# EAGLE design avr-isp-adapter (EAGLE 7.4.0)
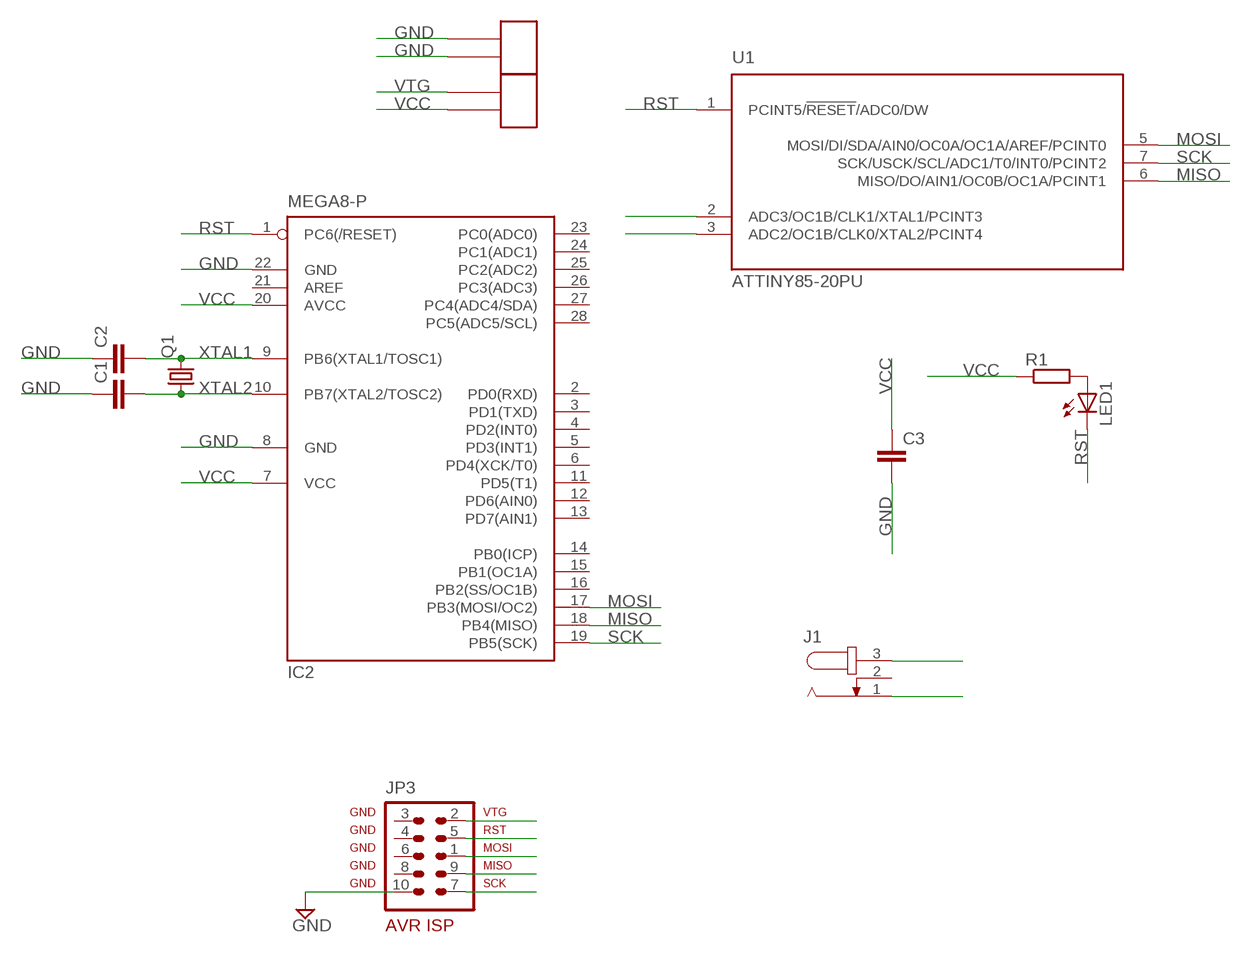
[diagram p0: schematic, sheet 1]

## Parts
C1  C-EUC0805  [C0805]
C2  C-EUC0805  [C0805]
C3  C-EUC0805  [C0805]
IC2  MEGA8-P  [DIL28-3]
J1  JACK-PLUG1  [SPC4078]
JP3  AVR-ISP-10  [AVR-ISP-10]
LED1  LED3MM  [LED3MM]
Q1  CRYSTALHC49S  [HC49/S]
R1  R-EU_M0805  [M0805]
U1  ATTINY85-20PU  [DIP-8]
U$1  MA02-1  [MA02-1]
U$2  MA02-1  [MA02-1]

## Nets
GND: C1.1 C2.1 C3.2 IC2.8(GND) IC2.22(GND) J1.1 JP3.10 U$2.P1 U$2.P2
MISO: IC2.18(PB4(MISO)) JP3.9 U1.6(MISO/DO/AIN1/OC0B/OC1A/PCINT1)
MOSI: IC2.17(PB3(MOSI/OC2)) JP3.1 U1.5(MOSI/DI/SDA/AIN0/OC0A/OC1A/AREF/PCINT0)
N$1: LED1.A R1.2
RST: IC2.1(PC6(/RESET)) JP3.5 LED1.K(C) U1.1(PCINT5/!RESET!/ADC0/DW)
SCK: IC2.19(PB5(SCK)) JP3.7 U1.7(SCK/USCK/SCL/ADC1/T0/INT0/PCINT2)
VCC: C3.1 IC2.7(VCC) IC2.20(AVCC) J1.3 R1.1 U$1.P2
VTG: JP3.2 U$1.P1
XTAL1: C2.2 IC2.9(PB6(XTAL1/TOSC1)) Q1.2 U1.2(ADC3/OC1B/CLK1/XTAL1/PCINT3)
XTAL2: C1.2 IC2.10(PB7(XTAL2/TOSC2)) Q1.1 U1.3(ADC2/OC1B/CLK0/XTAL2/PCINT4)
Unconnected: IC2.2(PD0(RXD)) IC2.3(PD1(TXD)) IC2.4(PD2(INT0)) IC2.5(PD3(INT1)) IC2.6(PD4(XCK/T0)) IC2.11(PD5(T1)) IC2.12(PD6(AIN0)) IC2.13(PD7(AIN1)) IC2.14(PB0(ICP)) IC2.15(PB1(OC1A)) IC2.16(PB2(SS/OC1B)) IC2.21(AREF) IC2.23(PC0(ADC0)) IC2.24(PC1(ADC1)) IC2.25(PC2(ADC2)) IC2.26(PC3(ADC3)) IC2.27(PC4(ADC4/SDA)) IC2.28(PC5(ADC5/SCL)) J1.2 JP3.3 JP3.4 JP3.6 JP3.8

## Power pins joined to a net without a drawn wire
GND: U1.4(GND)
VCC: U1.8(VCC)

## Library data of the parts
C1-C3 = rcl:C-EU: CAPACITOR, European symbol
IC2 = atmel:MEGA8-P: MICROCONTROLLER 8 Kbytes FLASH, 1 kbytes SRAM, 512 bytes EEPROM, USART, 4-channel 10 bit ADC, 2-channel 8 bit ADC Pin compatible with Atmega48, ATMega88, ATMega168 Source: avr.lbr; OC_FARNELL: unknown; OC_NEWARK: unknown
J1 = con-jack:JACK-PLUG: DC POWER JACK Power Jack, DC, Right Angle, Through Hole, Rated 5A at 16VDC, PC Terminals Distributor: Farnell (www.Farnell.de) Drawing: 84N1161.pdf / 84N1162.pdf Manufacturer: SPC Technology (www.spctechnology.com) Type: SPC4077 / SPC 4078; OC_FARNELL: unknown; OC_NEWARK: unknown
JP3 = my-atmel:AVR-ISP-10: AVR ISP-10 Serial Programming Header
LED1 = adafruit:LED: LED OSRAM: - CHIPLED LG R971, LG N971, LY N971, LG Q971, LY Q971, LO R971, LY R971 LH N974, LH R974 LS Q976, LO Q976, LY Q976 LO Q996 - Hyper CHIPLED LW Q18S LB Q993, LB Q99A, LB R99A - SideLED LS A670, LO A670, LY A670, LG A670, LP A670 LB A673, LV A673, LT A673, LW A673 LH A674 LY A675 LS A676, LA A676, LO A676, LY A676, LW A676 LS A679, LY A679, LG A679 - Hyper Micro SIDELED® LS Y876, LA Y876, LO Y876, LY Y876 LT Y87S - SmartLED LW L88C, LW L88S LB L89C, LB L89S, LG L890 LS L89K, LO L89K, LY L89K LS L896, LA L896, LO L896, LY L896 - TOPLED LS T670, LO T670, LY T670, LG T670, LP T670 LSG T670, LSP T670, LSY T670, LOP T670, LYG T670 LG T671, LOG T671, LSG T671 LB T673, LV T673, LT T673, LW T673 LH T674 LS T676, LA T676, LO T676, LY T676, LB T676, LH T676, LSB T676, LW T676 LB T67C, LV T67C, LT T67C, LS T67K, LO T67K, LY T67K, LW E67C LS E67B, LA E67B, LO E67B, LY E67B, LB E67C, LV E67C, LT E67C LW T67C LS T679, LY T679, LG T679 LS T770, LO T770, LY T770, LG T770, LP T770 LB T773, LV T773, LT T773, LW T773 LH T774 LS E675, LA E675, LY E675, LS T675 LS T776, LA T776, LO T776, LY T776, LB T776 LHGB T686 LT T68C, LB T68C - Hyper Mini TOPLED® LB M676 - Mini TOPLED Santana® LG M470 LS M47K, LO M47K, LY M47K Source: http://www.osram.convergy.de/
Q1 = crystal:CRYSTAL: CRYSTAL; OC_FARNELL: 1667008; OC_NEWARK: unknown
R1 = rcl:R-EU_: RESISTOR, European symbol
U1 = volks73-Atmel:ATTINY*5-?: AVR® ATtiny2/4/85 Microcontroller Atmel 8-bit AVR Microcontroller with 2/4/8K Bytes In-System Programmable Flash Documentation Datasheet <http://www.atmel.com/images/atmel-2586-avr-8-bit-microcontroller-attiny25-attiny45-attiny85_datasheet.pdf> Features High Performance, Low Power AVR® 8-Bit Microcontroller Advanced RISC Architecture 120 Powerful Instructions – Most Single Clock Cycle Execution 32 x 8 General Purpose Working Registers Fully Static Operation Non-volatile Program and Data Memories 2/4/8K Bytes of In-System Programmable Program Memory Flash Endurance: 10,000 Write/Erase Cycles 128/256/512 Bytes In-System Programmable EEPROM Endurance: 100,000 Write/Erase Cycles 128/256/512 Bytes Internal SRAM Programming Lock for Self-Programming Flash Program and EEPROM Data Security Peripheral Features 8-bit Timer/Counter with Prescaler and Two PWM Channels 8-bit High Speed Timer/Counter with Separate Prescaler 2 High Frequency PWM Outputs with Separate Output Compare Registers Programmable Dead Time Generator USI – Universal Serial Interface with Start Condition Detector 10-bit ADC 4 Single Ended Channels 2 Differential ADC Channel Pairs with Programmable Gain (1x, 20x) Temperature Measurement Programmable Watchdog Timer with Separate On-chip Oscillator On-chip Analog Comparator Special Microcontroller Features debugWIRE On-chip Debug System In-System Programmable via SPI Port External and Internal Interrupt Sources Low Power Idle, ADC Noise Reduction, and Power-down Modes Enhanced Power-on Reset Circuit Programmable Brown-out Detection Circuit Internal Calibrated Oscillator I/O and Packages Six Programmable I/O Lines 8-pin PDIP, 8-pin SOIC, 20-pad QFN/MLF, and 8-pin TSSOP (only ATtiny45/V) Operating Voltage 1.8 - 5.5V for ATtiny25V/45V/85V 2.7 - 5.5V for ATtiny25/45/85 Speed Grade ATtiny25V/45V/85V: 0 – 4 MHz @ 1.8 - 5.5V, 0 - 10 MHz @ 2.7 - 5.5V ATtiny25/45/85: 0 – 10 MHz @ 2.7 - 5.5V, 0 - 20 MHz @ 4.5 - 5.5V Industrial Temperature Range Low Power Consumption Active Mode: 1 MHz, 1.8V: 300 μA Power-down Mode: 0.1 μA at 1.8V; CONNECTIVITY: USI; CORE_PROCESSOR: AVR; CORE_SIZE: 8-Bit; DATA_CONVERTERS: A/D 4x10b; DESCRIPTION: IC MCU 8BIT 8KB FLASH 8DIP; DOCUMENTATION_LINK: <a href="http://www.atmel.com/images/atmel-2586-avr-8-bit-microcontroller-attiny25-attiny45-attiny85_datasheet.pdf">Datasheet</a>; DOCUMENTATION_URL: http://www.atmel.com/images/atmel-2586-avr-8-bit-microcontroller-attiny25-attiny45-attiny85_datasheet.pdf; EEPROM_SIZE: 512 x 8; MANUFACTURER: Atmel; NUMBER_OF_IO: 6; OPERATING_TEMPERATURE: -40C ~ 85C; OSCILLATOR_TYPE: Internal; PACKAGE: 8-DIP (0.300", 7.62mm); PART_NUMBER: ATTINY85-20PU; PERIPHERALS: Brown-out Detect/Reset, POR, PWM, WDT; PROGRAM_MEMORY_SIZE: 8KB (4K x 16); PROGRAM_MEMORY_TYPE: FLASH; RAM_SIZE: 512 x 8; SPEED: 20MHz; SUPPLIER_DEVICE_PACKAGE: 8-PDIP; SUPPLIER_ITEM_LINK: <a href="http://www.digikey.com/product-detail/en/ATTINY85-20PU/ATTINY85-20PU-ND/735469">Details</a>; SUPPLIER_ITEM_NUMBER: ATTINY85-20PU-ND; SUPPLIER_ITEM_URL: http://www.digikey.com/product-detail/en/ATTINY85-20PU/ATTINY85-20PU-ND/735469; SUPPLIER_LINK: <a href="http://www.digikey.com">Home Page</a>; SUPPLIER_NAME: Digi-Key; SUPPLIER_URL: http://www.digikey.com; VOLTAGE-SUPPLY: 2.7 ~ 5.5V
U$1 U$2 = my-con:MA02-1

## Board
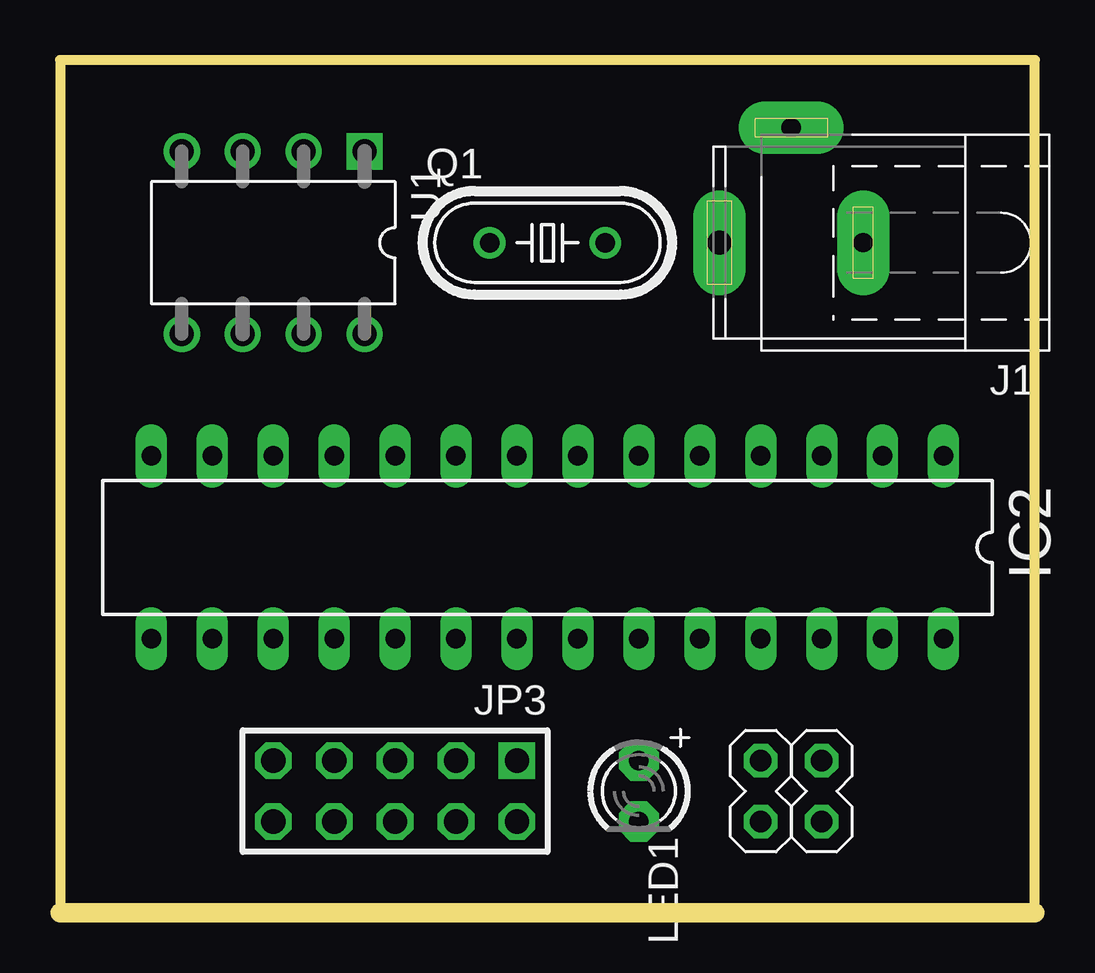
[diagram p1: board, top side]
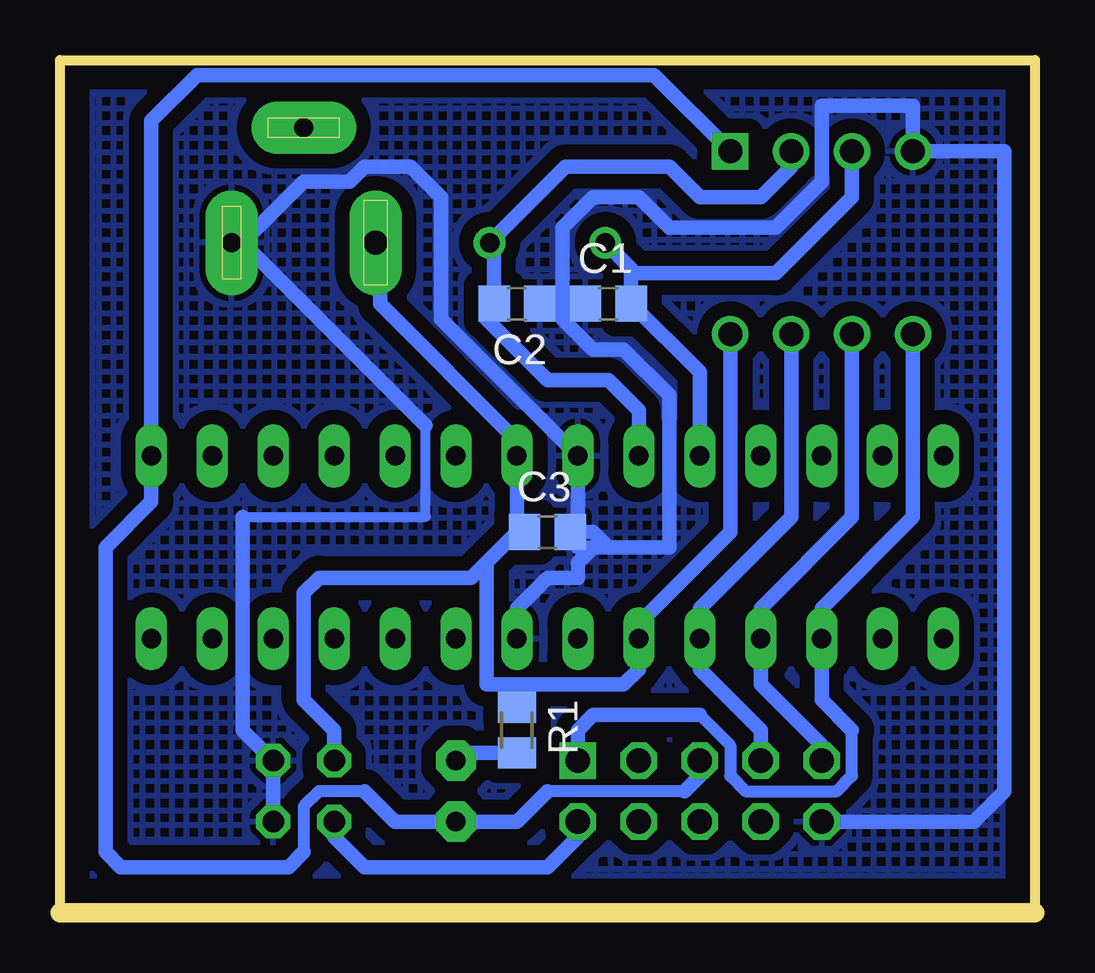
[diagram p2: board, bottom side, seen from below]

Size 40.64 x 35.56 mm. Coordinates in mm from the lower left corner, seen from the top.
Outline: 0,0 40.64,0 40.64,35.56 0,35.56 0,0
Copper layers (1*16): Top 0.035mm / dielectric 1.5mm / Bottom 0.035mm
Design rules "default": minimum track width 10mil, minimum drill 24mil, track to track 8mil, track to pad 8mil, pad to pad 8mil, via to via 8mil, smd to smd 8mil, copper to edge 40mil, drill to drill 8mil, minimum pad ring 10mil, minimum via ring 8mil, stop-mask expansion 4mil, vias tented up to drill 0mil, thermal gap 10mil

### Footprints (pad centres in the part's own frame; a part is rotated, then mirrored left to right if it is on the bottom)
C0805 = smd 1.3 x 1.5: 1 -0.95,0; 2 0.95,0
DIL28-3 = drill 0.813 long: 1 -16.51,-3.81; 2 -13.97,-3.81; 3 -11.43,-3.81; 4 -8.89,-3.81; 5 -6.35,-3.81; 6 -3.81,-3.81; 7 -1.27,-3.81; 8 1.27,-3.81; 9 3.81,-3.81; 10 6.35,-3.81; 11 8.89,-3.81; 12 11.43,-3.81; 13 13.97,-3.81; 14 16.51,-3.81; 15 16.51,3.81; 16 13.97,3.81; 17 11.43,3.81; 18 8.89,3.81; 19 6.35,3.81; 20 3.81,3.81; 21 1.27,3.81; 22 -1.27,3.81; 23 -3.81,3.81; 24 -6.35,3.81; 25 -8.89,3.81; 26 -11.43,3.81; 27 -13.97,3.81; 28 -16.51,3.81
SPC4078 = drill 0.8 pad 2.184 long: 1 -3,0; 2 0,-4.8 | drill 1 pad 2.184 long: 3 3,0
AVR-ISP-10 = drill 1.016 square: 1 -5.08,-1.27 | drill 1.016 octagon: 2 -5.08,1.27; 3 -2.54,-1.27; 4 -2.54,1.27; 5 0,-1.27; 6 0,1.27; 7 2.54,-1.27; 8 2.54,1.27; 9 5.08,-1.27; 10 5.08,1.27
LED3MM = drill 0.813 pad 1.676 octagon: A -1.27,0; K 1.27,0
HC49/S = drill 0.813: 1 -2.413,0; 2 2.413,0
M0805 = smd 1.3 x 1.6: 1 -0.95,0; 2 0.95,0
DIP-8 = drill 1 square: 1 -3.81,3.81 | drill 1: 2 -3.81,1.27; 3 -3.81,-1.27; 4 -3.81,-3.81; 5 3.81,-3.81; 6 3.81,-1.27; 7 3.81,1.27; 8 3.81,3.81
MA02-1 = drill 0.9 octagon: P1 -1.27,0; P2 1.27,0

### Placement (x,y rotation side)
C1  17.78,25.4 0 bottom
C2  21.59,25.4 180 bottom
C3  20.32,15.88 0 bottom
IC2  20.32,15.24 180 top
J1  30.48,27.94 180 top
JP3  13.97,5.08 180 top
LED1  24.13,5.08 270 top
Q1  20.32,27.94 0 top
R1  21.59,7.62 270 bottom
U1  8.89,27.94 270 top
U$1  29.21,5.08 90 top
U$2  31.75,5.08 90 top

### Tracks (layer width: path | path; a pad name or v marks a point on that pad's centre or on a via)
GND
  Bottom 0.406: 33.02,16.51 25.4,16.51 25.4,20.32
  Bottom 0.61: 18.41,15.24 19.05,15.24 IC2.8 24.77,24.77 24.77,29.84 26.04,31.11 27.94,31.11 28.57,30.48 30.48,30.48 33.02,27.94 | 18.41,15.24 17.78,15.24 | 17.78,15.24 15.24,15.24 15.24,21.59 17.14,23.5 18.41,23.5 19.68,24.77 19.68,25.4 | C2.1 19.68,25.4 | 19.68,25.4 C1.1 | IC2.22 21.59,12.7 20.32,13.97 19.05,13.97 19.05,14.61 18.41,15.24 | 19.68,25.4 19.68,28.57 18.41,29.84 16.51,29.84 15.24,28.57 10.79,28.57 8.89,30.48 8.89,33.66 5.08,33.66 U1.4 1.27,31.75 1.27,5.08 2.54,3.81 JP3.10 | C3.2 18.41,15.88 17.78,15.24 | U$2.P1 U$2.P2 33.02,7.62 33.02,16.51 | 25.4,20.32 33.02,27.94 | 33.02,27.94 J1.1
  pour Bottom (isolate 0.61, hatched): 0,0 0,35.56 40.64,35.56 40.64,0
MISO
  Bottom 0.61: JP3.9 8.89,6.99 11.43,9.53 IC2.18 11.43,12.7 7.62,16.51 U1.6
MOSI
  Bottom 0.508: 13.97,8.26 12.7,6.99 12.7,5.71 12.06,5.08 8.26,5.08 7.62,5.71 7.62,7.62
  Bottom 0.61: JP3.1 19.05,7.62 18.41,8.26 13.97,8.26 | 7.62,7.62 8.89,8.89 IC2.17 8.89,12.7 5.08,16.51 U1.5
N$1
  Bottom 0.61: R1.2 23.82,6.67 LED1.A
RST
  Bottom 0.508: 14.61,5.08 20.32,5.08 | 30.48,2.54 30.48,4.45 29.84,5.08 27.94,5.08
  Bottom 0.61: JP3.5 13.97,5.71 14.61,5.08 | U1.1 15.88,34.92 34.92,34.92 36.83,33.02 IC2.1 36.83,17.14 38.73,15.24 38.73,2.54 38.1,1.91 31.11,1.91 30.48,2.54 | 20.32,5.08 21.59,3.81 LED1.K 26.67,3.81 27.94,5.08
SCK
  Bottom 0.61: JP3.7 11.43,7.62 13.97,10.16 IC2.19 13.97,12.7 10.16,16.51 U1.7
VCC
  Bottom 0.508: C3.1 21.59,15.88
  Bottom 0.61: 22.86,14.61 21.59,15.88 IC2.7 21.59,19.68 27.3,25.4 27.3,27.77 J1.3 | 22.86,14.61 22.86,9.53 21.59,9.53 | U1.8 12.7,15.88 16.51,12.06 IC2.20 16.51,10.16 17.14,9.53 21.59,9.53 | U$1.P2 29.21,7.62 30.48,8.89 30.48,13.34 29.84,13.97 23.5,13.97 22.86,14.61 | R1.1 21.59,9.53
VTG
  Bottom 0.61: JP3.2 19.05,3.17 20.32,1.91 27.94,1.91 29.21,3.17 U$1.P1
XTAL1
  Bottom 0.61: U1.2 10.16,31.11 11.43,29.84 13.97,29.84 15.24,31.11 19.56,31.11 22.54,28.13 | 22.54,28.13 Q1.2 22.86,27.81 | IC2.9 16.51,20.95 17.78,22.23 20.32,22.23 22.86,24.77 22.86,25.08 C2.2 22.54,28.13
XTAL2
  Bottom 0.61: IC2.10 13.97,22.54 C1.2 16.83,26.86 | 16.83,26.86 Q1.1 | U1.3 7.62,29.84 10.79,26.67 16.64,26.67 arc90 16.83,26.86